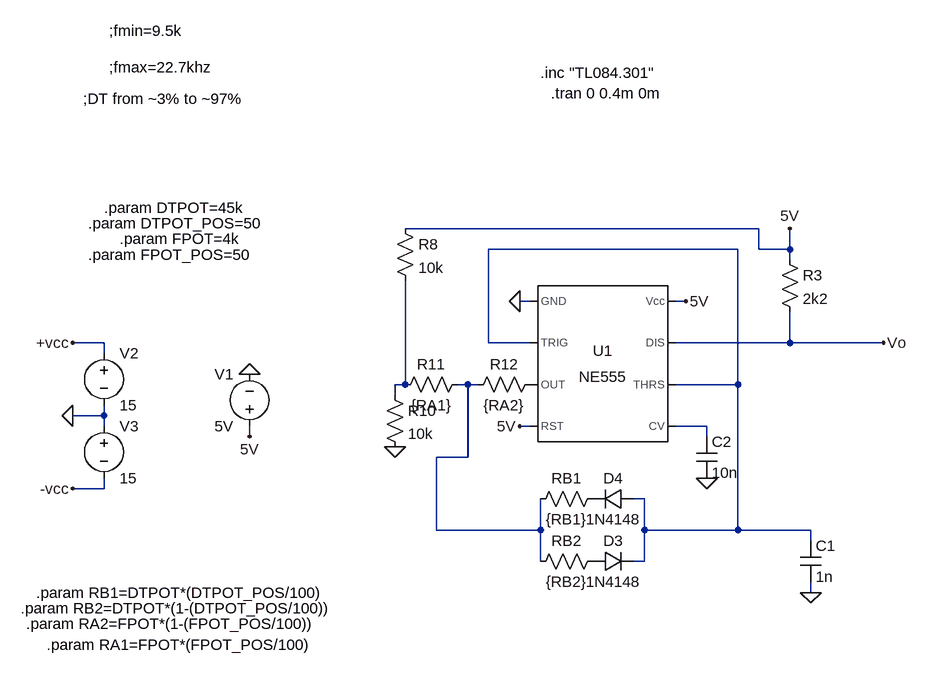
[diagram p0: schematic Oscilador.asc]
Oscilador.asc, the LTspice schematic file:
Version 4
SHEET 1 5044 916
WIRE -272 -48 -816 -48
WIRE -304 -16 -688 -16
WIRE -272 -16 -272 -48
WIRE -224 -16 -224 -48
WIRE -224 -16 -272 -16
WIRE -224 0 -224 -16
WIRE -624 64 -640 64
WIRE -384 64 -400 64
WIRE -1280 128 -1328 128
WIRE -688 128 -688 -16
WIRE -624 128 -688 128
WIRE -224 128 -224 80
WIRE -224 128 -400 128
WIRE -80 128 -224 128
WIRE -1280 144 -1280 128
WIRE -816 192 -816 32
WIRE -816 192 -832 192
WIRE -720 192 -736 192
WIRE -704 192 -720 192
WIRE -304 192 -304 -16
WIRE -304 192 -400 192
WIRE -832 208 -832 192
WIRE -1280 240 -1280 224
WIRE -1280 240 -1328 240
WIRE -1280 256 -1280 240
WIRE -624 256 -640 256
WIRE -352 256 -400 256
WIRE -1056 272 -1056 256
WIRE -352 272 -352 256
WIRE -720 304 -720 192
WIRE -720 304 -768 304
WIRE -1280 352 -1280 336
WIRE -1280 352 -1328 352
WIRE -448 368 -464 368
WIRE -768 416 -768 304
WIRE -608 416 -608 368
WIRE -608 416 -768 416
WIRE -448 416 -448 368
WIRE -304 416 -304 192
WIRE -304 416 -448 416
WIRE -192 416 -304 416
WIRE -192 432 -192 416
WIRE -608 464 -608 416
WIRE -448 464 -448 416
WIRE -448 464 -464 464
WIRE -192 512 -192 496
FLAG -640 64 0
FLAG -1056 176 0
FLAG -80 128 Vo
FLAG -192 512 0
FLAG -1328 240 0
FLAG -1328 128 +vcc
FLAG -1328 352 -vcc
FLAG -352 336 0
FLAG -1056 272 5V
FLAG -640 256 5V
FLAG -384 64 5V
FLAG -224 -48 5V
FLAG -832 288 0
SYMBOL Misc\\NE555 -512 160 R0
SYMATTR InstName U1
SYMBOL diode -528 480 R270
WINDOW 0 32 32 VTop 2
WINDOW 3 0 32 VBottom 2
SYMATTR InstName D3
SYMATTR Value 1N4148
SYMBOL diode -464 352 R90
WINDOW 0 0 32 VBottom 2
WINDOW 3 32 32 VTop 2
SYMATTR InstName D4
SYMATTR Value 1N4148
SYMBOL res -624 480 R270
WINDOW 0 32 56 VTop 2
WINDOW 3 0 56 VBottom 2
SYMATTR InstName RB2
SYMATTR Value {RB2}
SYMBOL res -624 384 R270
WINDOW 0 32 56 VTop 2
WINDOW 3 0 56 VBottom 2
SYMATTR InstName RB1
SYMATTR Value {RB1}
SYMBOL voltage -1056 272 R180
WINDOW 0 24 96 Left 2
WINDOW 3 24 16 Left 2
WINDOW 123 0 0 Left 0
WINDOW 39 0 0 Left 0
SYMATTR InstName V1
SYMATTR Value 5V
SYMBOL cap -208 432 R0
SYMATTR InstName C1
SYMATTR Value 1n
SYMBOL voltage -1280 128 R0
WINDOW 123 0 0 Left 0
WINDOW 39 0 0 Left 0
SYMATTR InstName V2
SYMATTR Value 15
SYMBOL voltage -1280 240 R0
WINDOW 123 0 0 Left 0
WINDOW 39 0 0 Left 0
SYMATTR InstName V3
SYMATTR Value 15
SYMBOL res -240 -16 R0
SYMATTR InstName R3
SYMATTR Value 2k2
SYMBOL cap -368 272 R0
SYMATTR InstName C2
SYMATTR Value 10n
SYMBOL res -832 -64 R0
SYMATTR InstName R8
SYMATTR Value 10k
SYMBOL res -848 192 R0
SYMATTR InstName R10
SYMATTR Value 10k
SYMBOL res -720 176 R90
WINDOW 0 0 56 VBottom 2
WINDOW 3 32 56 VTop 2
SYMATTR InstName R11
SYMATTR Value {RA1}
SYMBOL res -608 176 R90
WINDOW 0 0 56 VBottom 2
WINDOW 3 32 56 VTop 2
SYMATTR InstName R12
SYMATTR Value {RA2}
TEXT -592 -256 Left 2 !.tran 0 0.4m 0m
TEXT -608 -288 Left 2 !.inc "TL084.301"
TEXT -1384 512 Left 2 !.param RB1=DTPOT*(DTPOT_POS/100)
TEXT -1408 536 Left 2 !.param RB2=DTPOT*(1-(DTPOT_POS/100))
TEXT -1280 -80 Left 2 !.param DTPOT=45k
TEXT -1304 -56 Left 2 !.param DTPOT_POS=50
TEXT -1368 592 Left 2 !.param RA1=FPOT*(FPOT_POS/100)
TEXT -1400 560 Left 2 !.param RA2=FPOT*(1-(FPOT_POS/100))
TEXT -1304 -8 Left 2 !.param FPOT_POS=50
TEXT -1256 -32 Left 2 !.param FPOT=4k
TEXT -1272 -352 Left 2 !;fmin=9.5k
TEXT -1272 -296 Left 2 !;fmax=22.7khz
TEXT -1312 -248 Left 2 !;DT from ~3% to ~97%

The netlist it stands for:
* Oscilador.asc
XU1 0 N001 P001 5V N004 N001 Vo 5V NE555  ; pins GND TRIG OUT RST CV THRS DIS Vcc
D3 P002 N001 1N4148
D4 N001 P003 1N4148
RB2 N003 P002 {RB2}
RB1 N003 P003 {RB1}
V1 5V 0 5V
C1 N001 0 1n
V2 +vcc 0 15
V3 0 -vcc 15
R3 5V Vo 2k2
C2 N004 0 10n
R8 5V N002 10k
R10 N002 0 10k
R11 N003 N002 {RA1}
R12 P001 N003 {RA2}
.model D D
.lib standard.dio
.tran 0 0.4m 0m
.inc "TL084.301"
.param RB1=DTPOT*(DTPOT_POS/100)
.param RB2=DTPOT*(1-(DTPOT_POS/100))
.param DTPOT=45k
.param DTPOT_POS=50
.param RA1=FPOT*(FPOT_POS/100)
.param RA2=FPOT*(1-(FPOT_POS/100))
.param FPOT_POS=50
.param FPOT=4k
;fmin=9.5k
;fmax=22.7khz
;DT from ~3% to ~97%
.lib NE555.sub
.backanno
.end